# EAGLE design DIY (EAGLE 7.6.0)
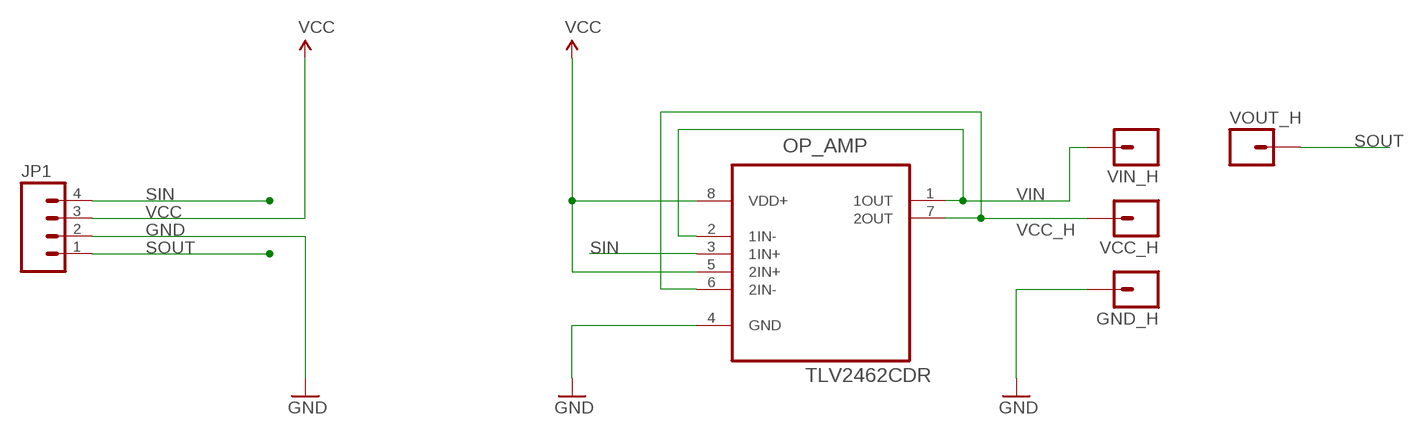
[diagram p0: schematic, sheet 1]

## Parts
GND_H  M01PTH  [1X01]
JP1  M04PTH  [1X04]
OP_AMP  TLV2462CDR  [SOIC127P600X175-8N]
VCC_H  M01PTH  [1X01]
VIN_H  M01PTH  [1X01]
VOUT_H  M01PTH  [1X01]

## Nets
GND: GND_H.1 JP1.2 OP_AMP.4(GND)
SIN: JP1.4 OP_AMP.3(1IN+)
SOUT: JP1.1 VOUT_H.1
VCC: JP1.3 OP_AMP.5(2IN+) OP_AMP.8(VDD+)
VCC_H: OP_AMP.6(2IN-) OP_AMP.7(2OUT) VCC_H.1
VIN: OP_AMP.1(1OUT) OP_AMP.2(1IN-) VIN_H.1

## Library data of the parts
GND_H VCC_H VIN_H VOUT_H = SparkFun-Connectors:M01: Header 1 Standard 1-pin 0.1" header. Use with straight break away headers (SKU : PRT-00116), right angle break away headers (PRT-00553), swiss pins (PRT-00743), machine pins (PRT-00117), and female headers (PRT-00115). SMTSO-256-ET is a "flush mount" nut for a 4-40 screw. The older package used to be too tight, and did not allow it to sit properly thru the drill hit. The latest (0.165DIA) fits nice and snug.
JP1 = SparkFun-Connectors:M04: Header 4 Standard 4-pin 0.1" header. Use with straight break away headers (SKU : PRT-00116), right angle break away headers (PRT-00553), swiss pins (PRT-00743), machine pins (PRT-00117), and female headers (PRT-00115). Molex polarized connector foot print use with SKU : PRT-08231 with associated crimp pins and housings. 1MM SMD Version SKU: PRT-10208
OP_AMP = Texas Instruments_By_element14_Batch_1:TLV2462CDR: OPERATIONAL AMPLIFIERS; MPN: TLV2462CDR; OC_FARNELL: 1535737; OC_NEWARK: 73C9479; PACKAGE: SOIC-8; SUPPLIER: Texas Instruments

## Board
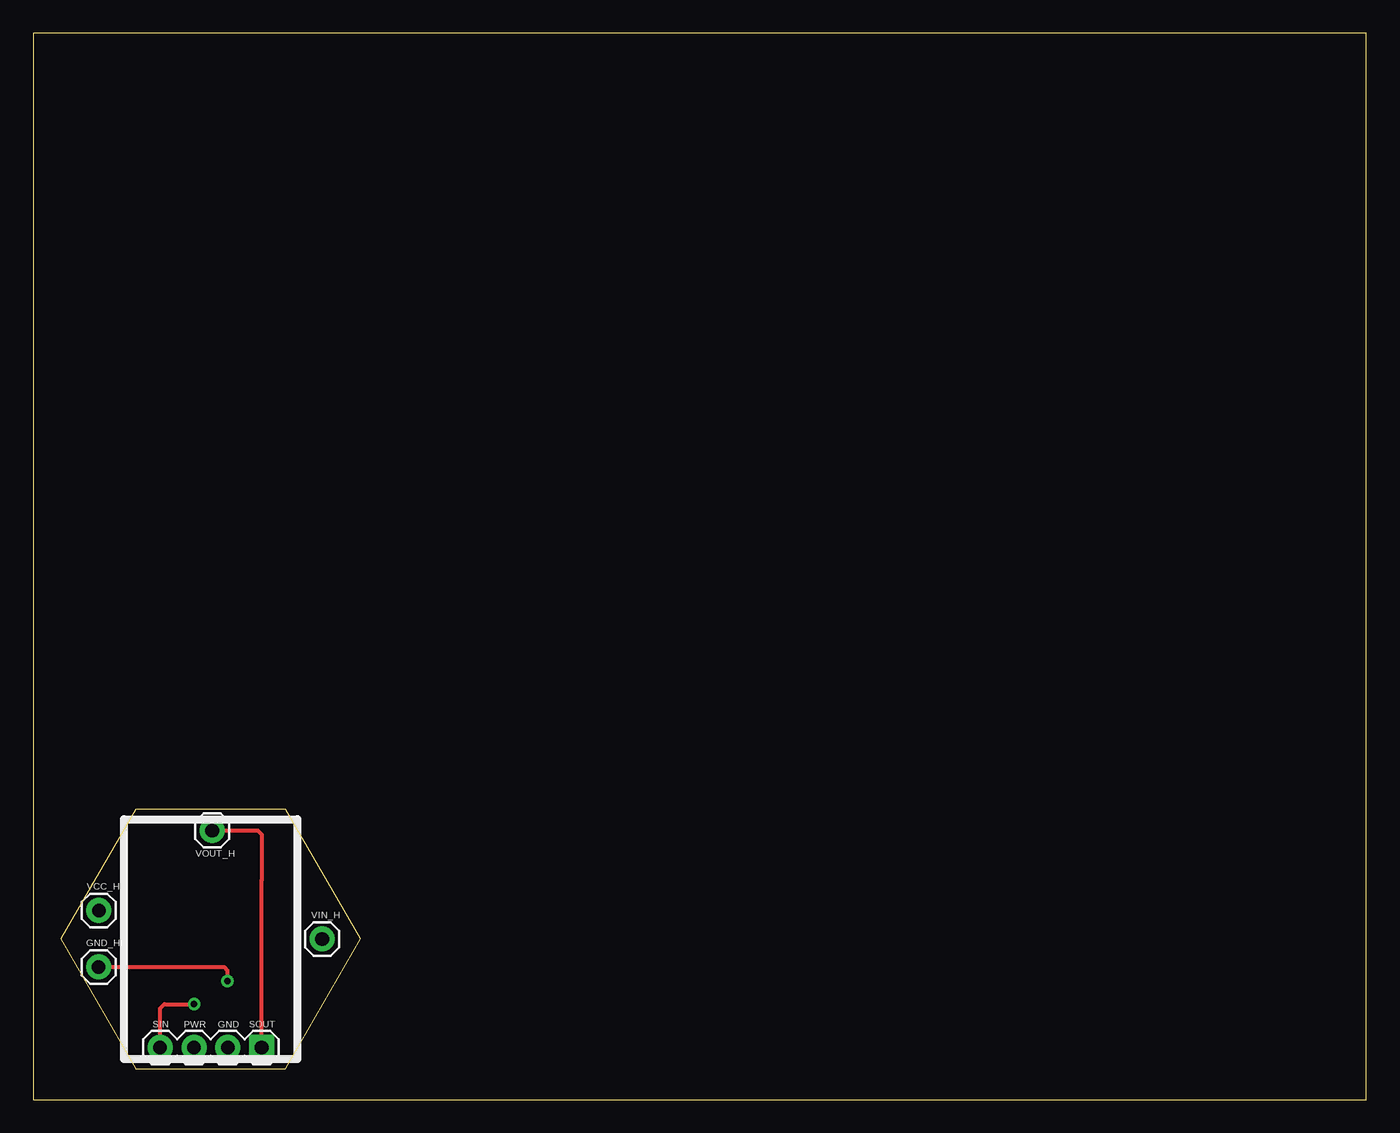
[diagram p1: board, top side]
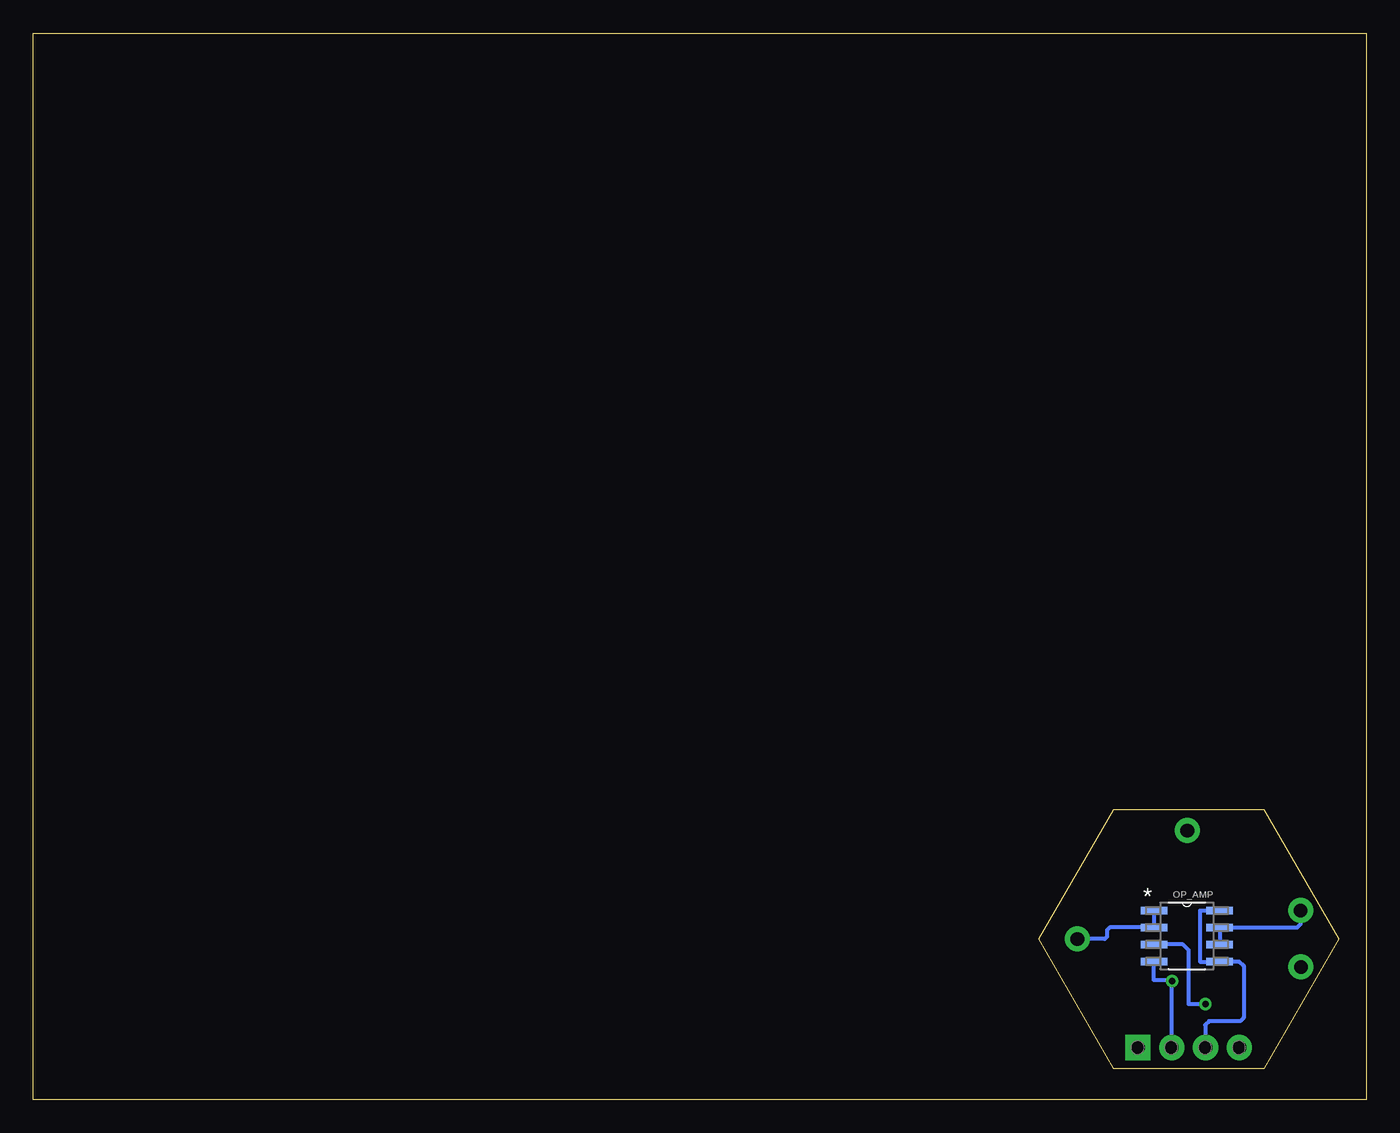
[diagram p2: board, bottom side, seen from below]

Size 100 x 80 mm. Coordinates in mm from the lower left corner, seen from the top.
Outline: 0,0 100,0 100,80 0,80 0,0
Outline: 7.69,2.3 18.94,2.3 24.56,12.04 18.94,21.78 7.69,21.78 2.06,12.04 7.69,2.3
Copper layers (1*16): Top 0.035mm / dielectric 1.5mm / Bottom 0.035mm
Design rules "default *": minimum track width 10mil, minimum drill 24mil, track to track 8mil, track to pad 8mil, pad to pad 8mil, via to via 8mil, smd to smd 8mil, copper to edge 0mil, drill to drill 8mil, minimum pad ring 10mil, minimum via ring 8mil, stop-mask expansion 4mil, vias tented up to drill 0mil, thermal gap 10mil

### Footprints (pad centres in the part's own frame; a part is rotated, then mirrored left to right if it is on the bottom)
1X01 = drill 1.016 pad 1.88: 1 0,0
1X04 = drill 1.016 pad 1.88 square: 1 0,0 | drill 1.016 pad 1.88: 2 2.54,0; 3 5.08,0; 4 7.62,0
SOIC127P600X175-8N = smd 1.981 x 0.559: 1 -2.464,1.905; 2 -2.464,0.635; 3 -2.464,-0.635; 4 -2.464,-1.905; 5 2.464,-1.905; 6 2.464,-0.635; 7 2.464,0.635; 8 2.464,1.905

### Placement (x,y rotation side)
GND_H  4.9,9.94 0 top
JP1  17.13,3.9 180 top
OP_AMP  13.45,12.27 0 bottom
VCC_H  4.91,14.18 0 top
VIN_H  21.67,12.04 0 top
VOUT_H  13.42,20.19 0 top

### Tracks (layer width: path | path; a pad name or v marks a point on that pad's centre or on a via)
GND  (via drill 0.5)
  Top 0.305: GND_H.1 14.3,9.94 14.56,9.68 v14.56,8.89
  Bottom 0.305: OP_AMP.4 15.91,8.95 14.65,8.95 14.59,8.89 v14.56,8.89 14.59,8.86 JP1.2
SIN  (via drill 0.5)
  Top 0.305: JP1.4 9.51,6.84 9.83,7.16 v12.06,7.16
  Bottom 0.305: v12.06,7.16 13.32,7.16 13.32,11.21 13.74,11.63 OP_AMP.3
SOUT
  Top 0.305: JP1.1 17.13,16.48 17.14,16.48 17.14,19.89 16.84,20.19 VOUT_H.1
VCC
  Bottom 0.305: OP_AMP.8 12.47,14.18 12.47,10.35 10.99,10.35 OP_AMP.5 9.54,10.37 9.2,10.02 9.2,6.14 9.46,5.88 11.78,5.88 12.07,5.59 12.07,3.92 JP1.3
VCC_H
  Bottom 0.305: OP_AMP.6 OP_AMP.7 5.18,12.9 4.91,13.18 VCC_H.1
VIN
  Bottom 0.305: OP_AMP.1 OP_AMP.2 19.25,12.9 19.45,12.7 19.45,12.21 19.62,12.04 VIN_H.1

### Text on the board
tPlace: SIN | PWR | GND | SOUT